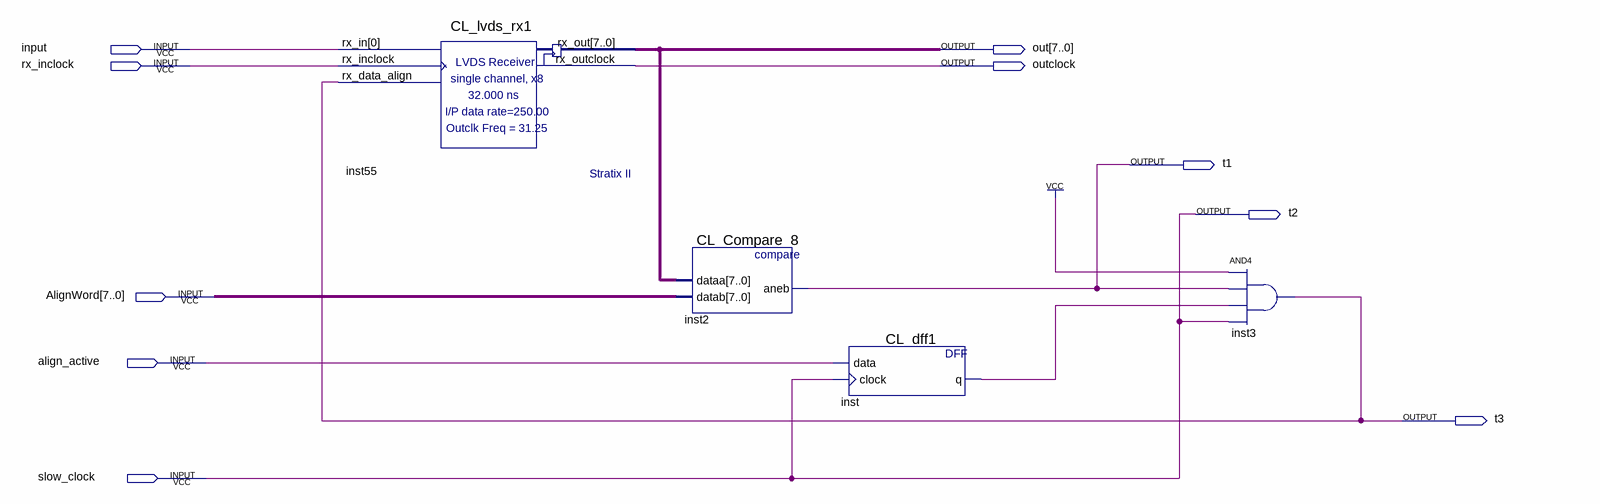
[diagram p0: schematic sheet]
// Quartus schematic CL_Rx.bdf as structural Verilog: 4 symbols, 10 pins
module CL_Rx (
  input  \input ,
  input  rx_inclock,
  input  [7:0] AlignWord,
  input  align_active,
  input  slow_clock,
  output [7:0] out,
  output outclock,
  output t1,
  output t2,
  output t3
);

  wire inst_q;

  CL_lvds_rx1 inst55 (
    .rx_in(\input ), .rx_inclock(rx_inclock), .rx_data_align(t3), .rx_out(out), .rx_outclock(outclock));
  CL_Compare_8 inst2 (.dataa(out), .datab(AlignWord), .aneb(t1));
  CL_dff1 inst (.data(align_active), .clock(slow_clock), .q(inst_q));
  and inst3 (t3, 1'b1, t1, inst_q, slow_clock);

  assign t2 = slow_clock;
endmodule
